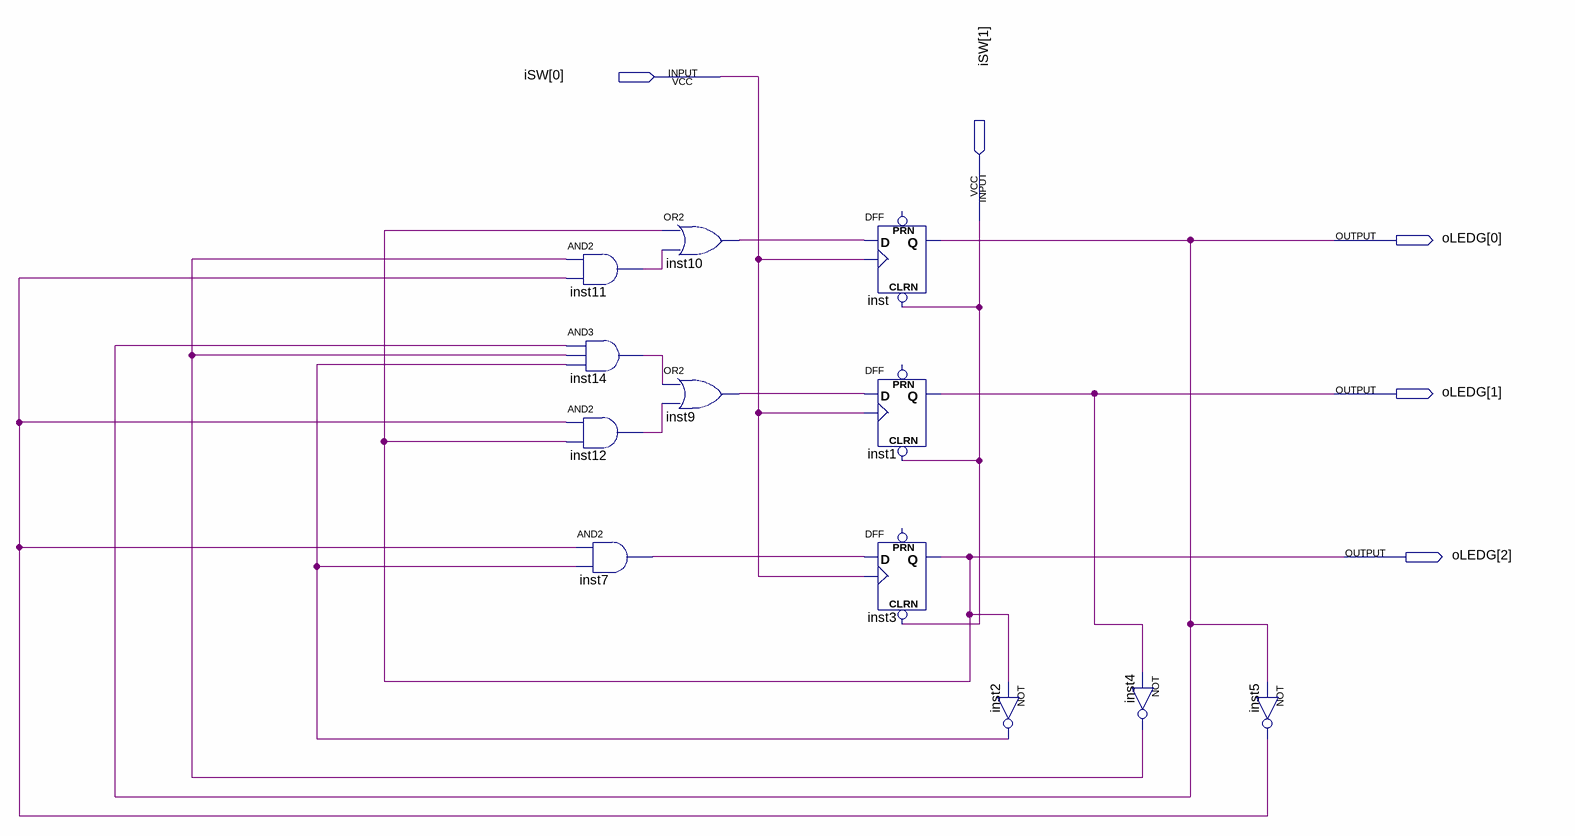
[diagram p0: schematic sheet]
// Quartus schematic Cwiczenie2_1.bdf as structural Verilog: 12 symbols, 5 pins
module Cwiczenie2_1 (
  input  [1:0] iSW,
  output [2:0] oLEDG
);

  wire inst2_out, inst4_out, inst5_out, inst7_out, inst9_out, inst10_out, inst11_out, inst12_out, inst14_out;

  and inst11 (inst11_out, inst4_out, inst5_out);
  and inst14 (inst14_out, oLEDG[0], inst4_out, inst2_out);
  and inst12 (inst12_out, inst5_out, oLEDG[2]);
  and inst7 (inst7_out, inst5_out, inst2_out);
  or inst10 (inst10_out, oLEDG[2], inst11_out);
  or inst9 (inst9_out, inst14_out, inst12_out);
  DFF inst (.CLRN(iSW[1]), .CLK(iSW[0]), .D(inst10_out), .Q(oLEDG[0]));  // open: PRN
  DFF inst1 (.CLRN(iSW[1]), .CLK(iSW[0]), .D(inst9_out), .Q(oLEDG[1]));  // open: PRN
  DFF inst3 (.CLRN(iSW[1]), .CLK(iSW[0]), .D(inst7_out), .Q(oLEDG[2]));  // open: PRN
  not inst2 (inst2_out, oLEDG[2]);
  not inst4 (inst4_out, oLEDG[1]);
  not inst5 (inst5_out, oLEDG[0]);
endmodule
